# Altium schematic sheet FT245.SchDoc
size A4
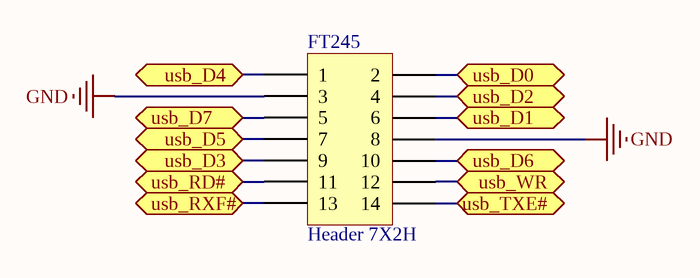
[diagram p0: FT245.SchDoc]

## Parts
FT245  Header 7X2H  [HDR2X7]

## Ports
usb_D0, usb_D1, usb_D2, usb_D3, usb_D4, usb_D5, usb_D6, usb_D7, usb_RD#, usb_RXF#, usb_TXE#, usb_WR

## Nets
GND: FT245.3 FT245.8
usb_D0: FT245.2 ; port usb_D0
usb_D1: FT245.6 ; port usb_D1
usb_D2: FT245.4 ; port usb_D2
usb_D3: FT245.9 ; port usb_D3
usb_D4: FT245.1 ; port usb_D4
usb_D5: FT245.7 ; port usb_D5
usb_D6: FT245.10 ; port usb_D6
usb_D7: FT245.5 ; port usb_D7
usb_RD#: FT245.11 ; port usb_RD#
usb_RXF#: FT245.13 ; port usb_RXF#
usb_TXE#: FT245.14 ; port usb_TXE#
usb_WR: FT245.12 ; port usb_WR

## Library data of the parts
FT245 = Header 7X2H: Header, 7-Pin, Dual row, Right Angle; LatestRevisionDate: 17-Jul-2002; LatestRevisionNote: Re-released for DXP Platform.; Publisher: Altium Limited